# Altium schematic sheet MCU.SchDoc: Title
size A2; Date: Date; CompanyName: Integrated Micro-Electronics Bulgaria; Organization: Design & Development Department; Address1: Drawing Type; Address2: Address 1; Address3: Address 2; Address4: Address 3; DocumentNumber: 730xxx; Revision: 01; SheetNumber: 1; SheetTotal: 1; PageSetup: Record=PageOptions|CenterHorizontal=True|CenterVertical=True|PrintScale=0.70|XCorrection=1.00|YCorrection=1.00|PrintKind=2|BorderSize=5000000|LeftOffset=0|BottomOffset=0|Orientation=2|PaperLength=1000|PaperWidth=1000|Scale=100|PaperSource=7|PrintQuality=-4|MediaType=1|DitherType=10|PaperKind=A4|PrintScaleMode=1; SheetSize: A3; Time: Time; ModifiedDate: Mod. Date
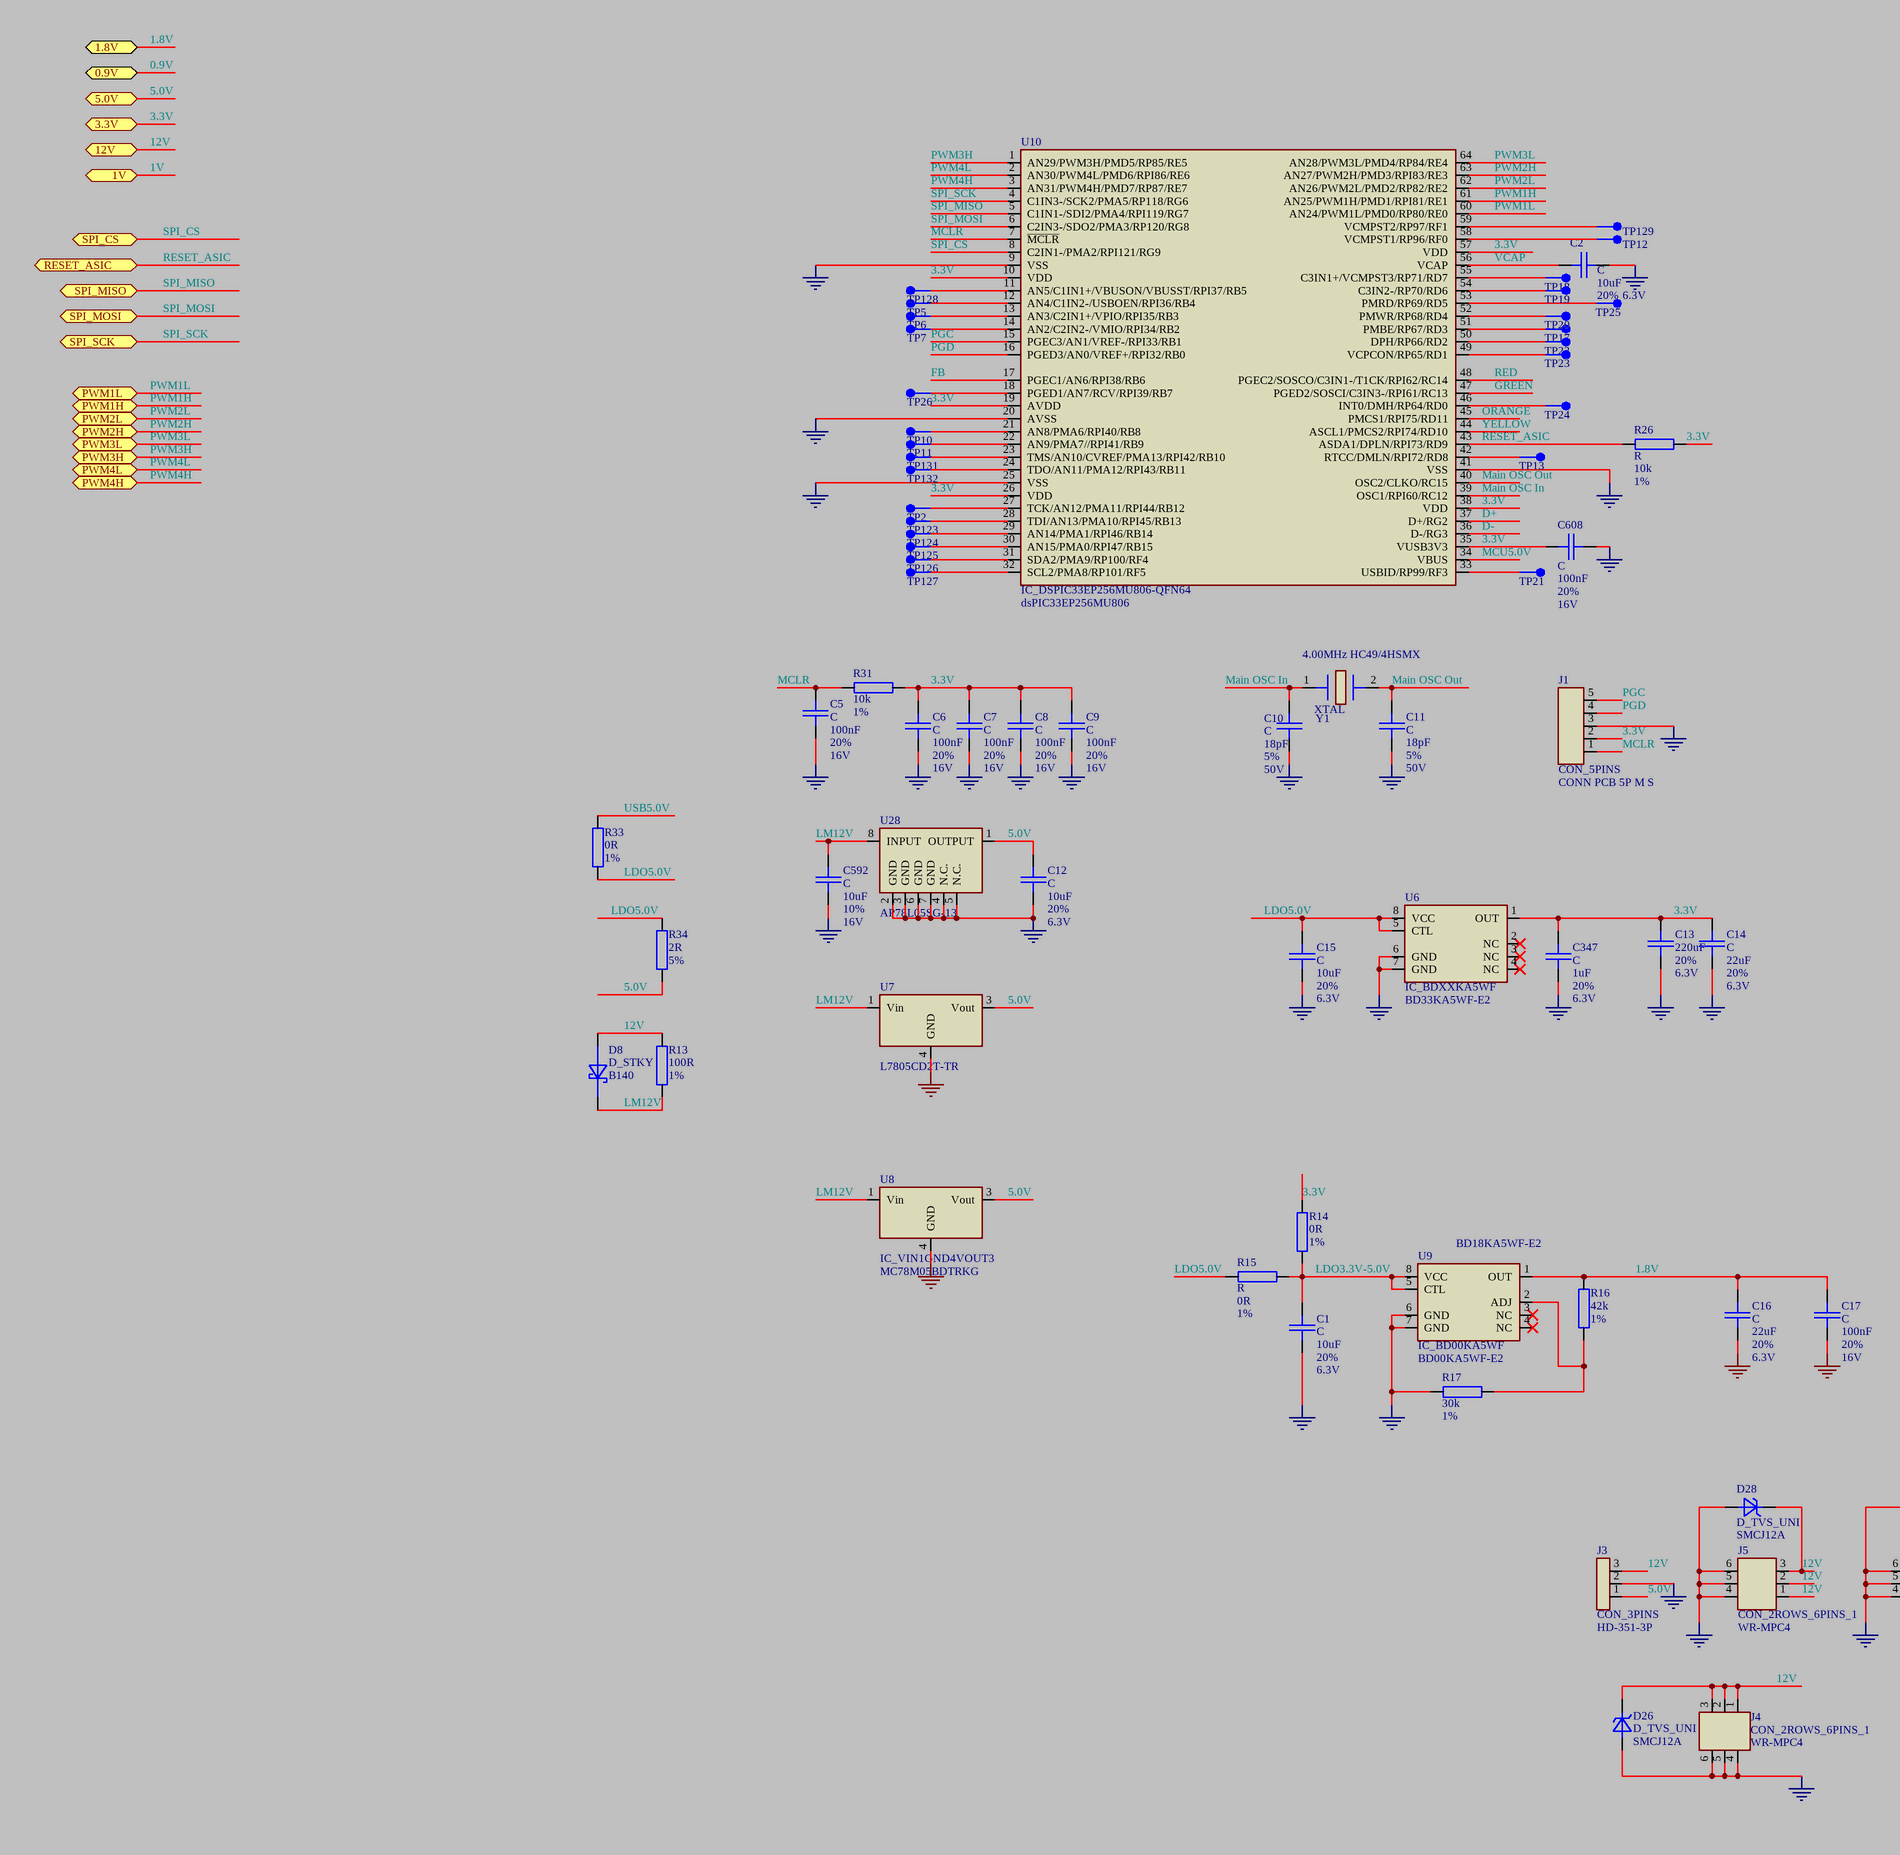
[diagram p0: MCU.SchDoc, left]
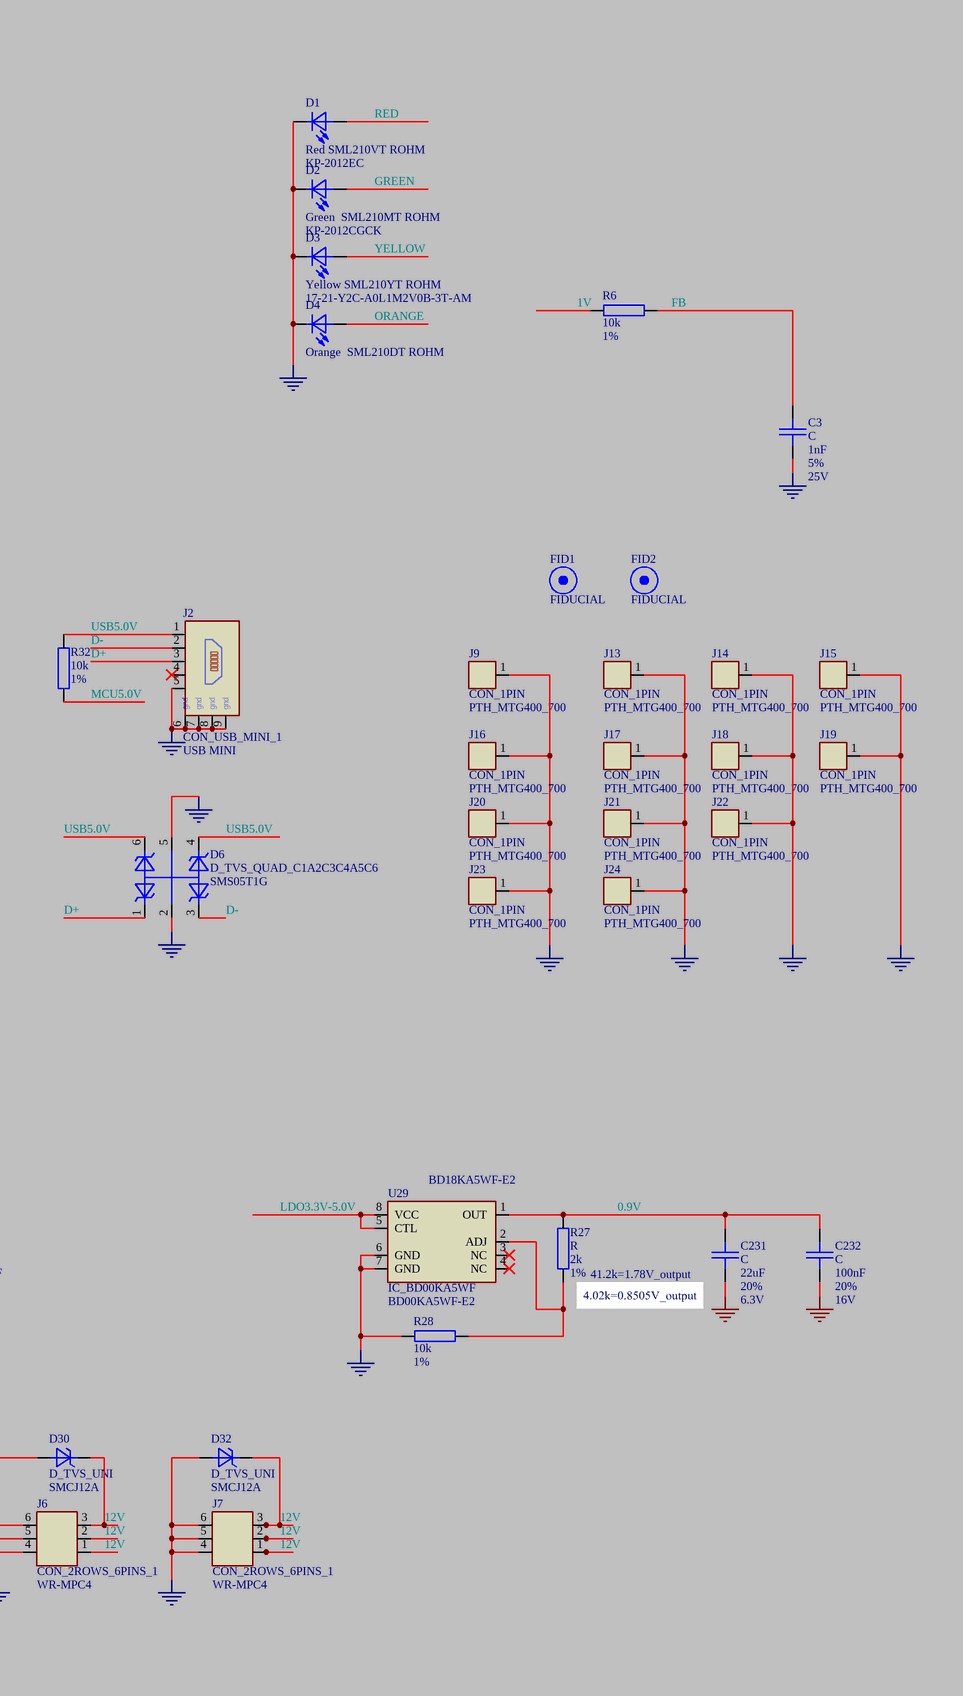
[diagram p1: MCU.SchDoc, right]

## Parts
C1  C  DB_VALUE: 10uF  DB_TOLERANCE: 20%  DB_VOLTAGE: 6.3V  [SMD_0603_CAPC1608X95N]
C2  C  DB_VALUE: 10uF  DB_TOLERANCE: 20%  DB_VOLTAGE: 6.3V  [SMD_0603_CAPC1608X95N]
C3  C  DB_VALUE: 1nF  DB_TOLERANCE: 5%  DB_VOLTAGE: 25V  [SMD_0603_CAPC1608X95N]
C5  C  DB_VALUE: 100nF  DB_TOLERANCE: 20%  DB_VOLTAGE: 16V  [SMD_0603_CAPC1608X95N]
C6  C  DB_VALUE: 100nF  DB_TOLERANCE: 20%  DB_VOLTAGE: 16V  [SMD_0603_CAPC1608X95N]
C7  C  DB_VALUE: 100nF  DB_TOLERANCE: 20%  DB_VOLTAGE: 16V  [SMD_0603_CAPC1608X95N]
C8  C  DB_VALUE: 100nF  DB_TOLERANCE: 20%  DB_VOLTAGE: 16V  [SMD_0603_CAPC1608X95N]
C9  C  DB_VALUE: 100nF  DB_TOLERANCE: 20%  DB_VOLTAGE: 16V  [SMD_0603_CAPC1608X95N]
C10  C  DB_VALUE: 18pF  DB_TOLERANCE: 5%  DB_VOLTAGE: 50V  [SMD_0603_CAPC1608X95N]
C11  C  DB_VALUE: 18pF  DB_TOLERANCE: 5%  DB_VOLTAGE: 50V  [SMD_0603_CAPC1608X95N]
C12  C  DB_VALUE: 10uF  DB_TOLERANCE: 20%  DB_VOLTAGE: 6.3V  [SMD_0603_CAPC1608X95N]
C13  DB_VALUE: 220uF  DB_TOLERANCE: 20%  DB_VOLTAGE: 6.3V  [SMD_1210_CAPC3225X279N]  (hidden comment: C)
C14  C  DB_VALUE: 22uF  DB_TOLERANCE: 20%  DB_VOLTAGE: 6.3V  [SMD_0805_CAPC2012X145N]
C15  C  DB_VALUE: 10uF  DB_TOLERANCE: 20%  DB_VOLTAGE: 6.3V  [SMD_0603_CAPC1608X95N]
C16  C  DB_VALUE: 22uF  DB_TOLERANCE: 20%  DB_VOLTAGE: 6.3V  [SMD_0805_CAPC2012X145N]
C17  C  DB_VALUE: 100nF  DB_TOLERANCE: 20%  DB_VOLTAGE: 16V  [SMD_0603_CAPC1608X95N]
C231  C  DB_VALUE: 22uF  DB_TOLERANCE: 20%  DB_VOLTAGE: 6.3V  [SMD_0805_CAPC2012X145N]
C232  C  DB_VALUE: 100nF  DB_TOLERANCE: 20%  DB_VOLTAGE: 16V  [SMD_0603_CAPC1608X95N]
C347  C  DB_VALUE: 1uF  DB_TOLERANCE: 20%  DB_VOLTAGE: 6.3V  [SMD_0603_CAPC1608X95N]
C592  C  DB_VALUE: 10uF  DB_TOLERANCE: 10%  DB_VOLTAGE: 16V  [SMD_0805_CAPC2012X145N]
C608  C  DB_VALUE: 100nF  DB_TOLERANCE: 20%  DB_VOLTAGE: 16V  [SMD_0603_CAPC1608X95N]
D1  Red SML210VT ROHM  DB_VALUE: KP-2012EC  [SMD_0805_LED2012X100N]
D2  Green  SML210MT ROHM  DB_VALUE: KP-2012CGCK  [SMD_0805_LED2012X100N]
D3  Yellow SML210YT ROHM  DB_VALUE: 17-21-Y2C-A0L1M2V0B-3T-AM  [SMD_0805_LED2012X100N]
D4  Orange  SML210DT ROHM  [SMD_0805_LED2012X100N]
D6  D_TVS_QUAD_C1A2C3C4A5C6  DB_VALUE: SMS05T1G  [SMD_SOT457_SOT95P275X110-6N]
D8  D_STKY  DB_VALUE: B140  [SMD_DO214AC_SMA]
D26  D_TVS_UNI  DB_VALUE: SMCJ12A  [SMD_DO214AC_SMC]
D28  D_TVS_UNI  DB_VALUE: SMCJ12A  [SMD_DO214AC_SMC]
D30  D_TVS_UNI  DB_VALUE: SMCJ12A  [SMD_DO214AC_SMC]
D32  D_TVS_UNI  DB_VALUE: SMCJ12A  [SMD_DO214AC_SMC]
FID1  FIDUCIAL  [FID100X200]
FID2  FIDUCIAL  [FID100X200]
J1  CON_5PINS  DB_VALUE: CONN PCB 5P M S  [PTH_HDRV05W64P254_1X05]
J2  CON_USB_MINI_1  DB_VALUE: USB MINI  [SMD_CON-CVILUX-CU04-SCM15B0]
J3  CON_3PINS  DB_VALUE: HD-351-3P  [PTH_CON_HD-351-3P]
J4  CON_2ROWS_6PINS_1  DB_VALUE: WR-MPC4  [PTH_CON_WR-MRC4-6P]
J5  CON_2ROWS_6PINS_1  DB_VALUE: WR-MPC4  [PTH_CON_WR-MRC4-6P]
J6  CON_2ROWS_6PINS_1  DB_VALUE: WR-MPC4  [PTH_CON_WR-MRC4-6P]
J7  CON_2ROWS_6PINS_1  DB_VALUE: WR-MPC4  [PTH_CON_WR-MRC4-6P]
J9  CON_1PIN  [PTH_MTG400_700]
J13  CON_1PIN  [PTH_MTG400_700]
J14  CON_1PIN  [PTH_MTG400_700]
J15  CON_1PIN  [PTH_MTG400_700]
J16  CON_1PIN  [PTH_MTG400_700]
J17  CON_1PIN  [PTH_MTG400_700]
J18  CON_1PIN  [PTH_MTG400_700]
J19  CON_1PIN  [PTH_MTG400_700]
J20  CON_1PIN  [PTH_MTG400_700]
J21  CON_1PIN  [PTH_MTG400_700]
J22  CON_1PIN  [PTH_MTG400_700]
J23  CON_1PIN  [PTH_MTG400_700]
J24  CON_1PIN  [PTH_MTG400_700]
R6  DB_VALUE: 10k  DB_TOLERANCE: 1%  [SMD_0603_RESC1608X55N]  (hidden comment: R)
R13  DB_VALUE: 100R  DB_TOLERANCE: 1%  [SMD_1206_RESC3216X65N]  (hidden comment: R)
R14  DB_VALUE: 0R  DB_TOLERANCE: 1%  [SMD_1206_RESC3216X65N]  (hidden comment: R)
R15  R  DB_VALUE: 0R  DB_TOLERANCE: 1%  [SMD_1206_RESC3216X65N]
R16  DB_VALUE: 42k  DB_TOLERANCE: 1%  [SMD_0603_RESC1608X55N]  (hidden comment: R_42k)
R17  DB_VALUE: 30k  DB_TOLERANCE: 1%  [SMD_0603_RESC1608X55N]  (hidden comment: R)
R26  R  DB_VALUE: 10k  DB_TOLERANCE: 1%  [SMD_0603_RESC1608X55N]
R27  R  DB_VALUE: 2k  DB_TOLERANCE: 1%  [SMD_0603_RESC1608X55N]
R28  DB_VALUE: 10k  DB_TOLERANCE: 1%  [SMD_0603_RESC1608X55N]  (hidden comment: R)
R31  DB_VALUE: 10k  DB_TOLERANCE: 1%  [SMD_0603_RESC1608X55N]  (hidden comment: R)
R32  DB_VALUE: 10k  DB_TOLERANCE: 1%  [SMD_0603_RESC1608X55N]  (hidden comment: R)
R33  DB_VALUE: 0R  DB_TOLERANCE: 1%  [SMD_0603_RESC1608X55N]  (hidden comment: R)
R34  DB_VALUE: 2R  DB_TOLERANCE: 5%  [SMD_1206_RESC3216X65N]  (hidden comment: R)
TP2  TEST_POINT_1  [SMD_TP_100-254]  (value not drawn)
TP5  TEST_POINT_1  [SMD_TP_100-254]  (value not drawn)
TP6  TEST_POINT_1  [SMD_TP_100-254]  (value not drawn)
TP7  TEST_POINT_1  [SMD_TP_100-254]  (value not drawn)
TP10  TEST_POINT_1  [SMD_TP_100-254]  (value not drawn)
TP11  TEST_POINT_1  [SMD_TP_100-254]  (value not drawn)
TP12  TEST_POINT_1  [SMD_TP_100-254]  (value not drawn)
TP13  TEST_POINT_1  [SMD_TP_100-254]  (value not drawn)
TP17  TEST_POINT_1  [SMD_TP_100-254]  (value not drawn)
TP18  TEST_POINT_1  [SMD_TP_100-254]  (value not drawn)
TP19  TEST_POINT_1  [SMD_TP_100-254]  (value not drawn)
TP20  TEST_POINT_1  [SMD_TP_100-254]  (value not drawn)
TP21  TEST_POINT_1  [SMD_TP_100-254]  (value not drawn)
TP22  TEST_POINT_1  [SMD_TP_100-254]  (value not drawn)
TP23  TEST_POINT_1  [SMD_TP_100-254]  (value not drawn)
TP24  TEST_POINT_1  [SMD_TP_100-254]  (value not drawn)
TP25  TEST_POINT_1  [SMD_TP_100-254]  (value not drawn)
TP26  TEST_POINT_1  [SMD_TP_100-254]  (value not drawn)
TP123  TEST_POINT_1  [SMD_TP_100-254]  (value not drawn)
TP124  TEST_POINT_1  [SMD_TP_100-254]  (value not drawn)
TP125  TEST_POINT_1  [SMD_TP_100-254]  (value not drawn)
TP126  TEST_POINT_1  [SMD_TP_100-254]  (value not drawn)
TP127  TEST_POINT_1  [SMD_TP_100-254]  (value not drawn)
TP128  TEST_POINT_1  [SMD_TP_100-254]  (value not drawn)
TP129  TEST_POINT_1  [SMD_TP_100-254]  (value not drawn)
TP131  TEST_POINT_1  [SMD_TP_100-254]  (value not drawn)
TP132  TEST_POINT_1  [SMD_TP_100-254]  (value not drawn)
U6  IC_BDXXKA5WF  DB_VALUE: BD33KA5WF-E2  [SMD_SOIC127P620X160-8N]
U7  DB_VALUE: L7805CD2T-TR  [SMD_TO254P1542X460-3_4N]  (hidden comment: IC_IN1OUT3GND4)
U8  IC_VIN1GND4VOUT3  DB_VALUE: MC78M05BDTRKG  [SMD_TO229P991X239-4N_DPAK]
U9  IC_BD00KA5WF  DB_VALUE: BD00KA5WF-E2  [SMD_SOIC127P620X160-8N]
U10  IC_DSPIC33EP256MU806-QFN64  DB_VALUE: dsPIC33EP256MU806  [SMD_QFP50P1200X1200X120-64N]
U28  DB_VALUE: AP78L05SG-13  [SMD_SOIC127P600X175-8N]  (hidden comment: IC_LM2931AD-5.0R2G_SO-8)
U29  IC_BD00KA5WF  DB_VALUE: BD00KA5WF-E2  [SMD_SOIC127P620X160-8N]
Y1  XTAL  DB_VALUE: 4.00MHz HC49/4HSMX  [SMD_HC49_XTAL1140X480X420N]

## Ports
0.9V, 1.8V, 1V, 3.3V, 5.0V, 12V, PWM1H, PWM1L, PWM2H, PWM2L, PWM3H, PWM3L, PWM4H, PWM4L, RESET_ASIC, SPI_CS, SPI_MISO, SPI_MOSI, SPI_SCK

## Nets
GND: C1.2 C2.2 C3.2 C5.2 C6.2 C7.2 C8.2 C9.2 C10.2 C11.2 C12.2 C13.1 C14.2 C15.2 C16.2 C17.2 C231.2 C232.2 C347.2 C592.2 C608.2 D1.1(C) D2.1(C) D3.1(C) D4.1(C) D6.2 D6.5 D26.2(A) D28.2(A) D30.2(A) D32.2(A) J1.3 J2.5 J2.6 J2.7 J2.8 J2.9 J3.2 J4.4 J4.5 J4.6 J5.4 J5.5 J5.6 J6.4 J6.5 J6.6 J7.4 J7.5 J7.6 J9.1 J13.1 J14.1 J15.1 J16.1 J17.1 J18.1 J19.1 J20.1 J21.1 J22.1 J23.1 J24.1 R17.2 R28.2 U6.6(GND) U6.7(GND) U7.4(GND) U8.4(GND) U9.6(GND) U9.7(GND) U10.9(VSS) U10.20(AVSS) U10.25(VSS) U10.41(VSS) U28.2(GND) U28.3(GND) U28.4(N.C.) U28.5(N.C.) U28.6(GND) U28.7(GND) U29.6(GND) U29.7(GND)
0.9V: C231.1 C232.1 R27.1 U29.1(OUT) ; port 0.9V
1.8V: C16.1 C17.1 R16.1 U9.1(OUT) ; port 1.8V
1V: R6.2 ; port 1V
3.3V: C6.1 C7.1 C8.1 C9.1 C13.2 C14.1 C347.1 C608.1 J1.2 R14.2 R26.1 R31.2 U6.1(OUT) U10.10(VDD) U10.19(AVDD) U10.26(VDD) U10.35(VUSB3V3) U10.38(VDD) U10.57(VDD) ; port 3.3V
5.0V: C12.1 J3.1 R34.1 U7.3(Vout) U8.3(Vout) U28.1(OUTPUT) ; port 5.0V
12V: D8.2(A) D26.1(C) D28.1(C) D30.1(C) D32.1(C) J3.3 J4.1 J4.2 J4.3 J5.1 J5.2 J5.3 J6.1 J6.2 J6.3 J7.1 J7.2 J7.3 R13.2 ; port 12V
D+: D6.1 J2.3 U10.37(D+/RG2)
D-: D6.3 J2.2 U10.36(D-/RG3)
FB: C3.1 R6.1 U10.17(PGEC1/AN6/RPI38/RB6)
GREEN: D2.2(A) U10.47(PGED2/SOSCI/C3IN3-/RPI61/RC13)
LDO3.3V-5.0V: C1.1 R14.1 R15.1 U9.5(CTL) U9.8(VCC) U29.5(CTL) U29.8(VCC)
LDO5.0V: C15.1 R15.2 R33.1 R34.2 U6.5(CTL) U6.8(VCC)
LM12V: C592.1 D8.1(C) R13.1 U7.1(Vin) U8.1(Vin) U28.8(INPUT)
Main OSC In: C10.1 U10.39(OSC1/RPI60/RC12) Y1.1
Main OSC Out: C11.1 U10.40(OSC2/CLKO/RC15) Y1.2
MCLR: C5.1 J1.1 R31.1 U10.7(~{MCLR})
MCU5.0V: R32.2 U10.34(VBUS)
ORANGE: D4.2(A) U10.45(PMCS1/RPI75/RD11)
PGC: J1.5 U10.15(PGEC3/AN1/VREF-/RPI33/RB1)
PGD: J1.4 U10.16(PGED3/AN0/VREF+/RPI32/RB0)
PWM1H: U10.61(AN25/PWM1H/PMD1/RPI81/RE1) ; port PWM1H
PWM1L: U10.60(AN24/PWM1L/PMD0/RP80/RE0) ; port PWM1L
PWM2H: U10.63(AN27/PWM2H/PMD3/RPI83/RE3) ; port PWM2H
PWM2L: U10.62(AN26/PWM2L/PMD2/RP82/RE2) ; port PWM2L
PWM3H: U10.1(AN29/PWM3H/PMD5/RP85/RE5) ; port PWM3H
PWM3L: U10.64(AN28/PWM3L/PMD4/RP84/RE4) ; port PWM3L
PWM4H: U10.3(AN31/PWM4H/PMD7/RP87/RE7) ; port PWM4H
PWM4L: U10.2(AN30/PWM4L/PMD6/RPI86/RE6) ; port PWM4L
RED: D1.2(A) U10.48(PGEC2/SOSCO/C3IN1-/T1CK/RPI62/RC14)
RESET_ASIC: R26.2 U10.43(ASDA1/DPLN/RPI73/RD9) ; port RESET_ASIC
SPI_CS: U10.8(C2IN1-/PMA2/RPI121/RG9) ; port SPI_CS
SPI_MISO: U10.5(C1IN1-/SDI2/PMA4/RPI119/RG7) ; port SPI_MISO
SPI_MOSI: U10.6(C2IN3-/SDO2/PMA3/RP120/RG8) ; port SPI_MOSI
SPI_SCK: U10.4(C1IN3-/SCK2/PMA5/RP118/RG6) ; port SPI_SCK
USB5.0V: D6.4 D6.6 J2.1 R32.1 R33.2
VCAP: C2.1 U10.56(VCAP)
YELLOW: D3.2(A) U10.44(ASCL1/PMCS2/RPI74/RD10)
NetR16_2: R16.2 R17.1 U9.2(ADJ)
NetR27_2: R27.2 R28.1 U29.2(ADJ)
NetTP2_1: TP2.1 U10.27(TCK/AN12/PMA11/RPI44/RB12)
NetTP5_1: TP5.1 U10.12(AN4/C1IN2-/USBOEN/RPI36/RB4)
NetTP6_1: TP6.1 U10.13(AN3/C2IN1+/VPIO/RPI35/RB3)
NetTP7_1: TP7.1 U10.14(AN2/C2IN2-/VMIO/RPI34/RB2)
NetTP10_1: TP10.1 U10.21(AN8/PMA6/RPI40/RB8)
NetTP11_1: TP11.1 U10.22(AN9/PMA7//RPI41/RB9)
NetTP12_1: TP12.1 U10.58(VCMPST1/RP96/RF0)
NetTP13_1: TP13.1 U10.42(RTCC/DMLN/RPI72/RD8)
NetTP17_1: TP17.1 U10.51(PMBE/RP67/RD3)
NetTP18_1: TP18.1 U10.55(C3IN1+/VCMPST3/RP71/RD7)
NetTP19_1: TP19.1 U10.54(C3IN2-/RP70/RD6)
NetTP20_1: TP20.1 U10.52(PMWR/RP68/RD4)
NetTP21_1: TP21.1 U10.33(USBID/RP99/RF3)
NetTP22_1: TP22.1 U10.50(DPH/RP66/RD2)
NetTP23_1: TP23.1 U10.49(VCPCON/RP65/RD1)
NetTP24_1: TP24.1 U10.46(INT0/DMH/RP64/RD0)
NetTP25_1: TP25.1 U10.53(PMRD/RP69/RD5)
NetTP26_1: TP26.1 U10.18(PGED1/AN7/RCV/RPI39/RB7)
NetTP123_1: TP123.1 U10.28(TDI/AN13/PMA10/RPI45/RB13)
NetTP124_1: TP124.1 U10.29(AN14/PMA1/RPI46/RB14)
NetTP125_1: TP125.1 U10.30(AN15/PMA0/RPI47/RB15)
NetTP126_1: TP126.1 U10.31(SDA2/PMA9/RP100/RF4)
NetTP127_1: TP127.1 U10.32(SCL2/PMA8/RP101/RF5)
NetTP128_1: TP128.1 U10.11(AN5/C1IN1+/VBUSON/VBUSST/RPI37/RB5)
NetTP129_1: TP129.1 U10.59(VCMPST2/RP97/RF1)
NetTP131_1: TP131.1 U10.23(TMS/AN10/CVREF/PMA13/RPI42/RB10)
NetTP132_1: TP132.1 U10.24(TDO/AN11/PMA12/RPI43/RB11)

Not connected (* = marked no-connect by the designer): J2 4*; U6 2(NC)* 3(NC)* 4(NC)*; U9 3(NC)* 4(NC)*; U29 3(NC)* 4(NC)*

## Notes on the sheet
- (near U9) BD18KA5WF-E2
- (near U29) BD18KA5WF-E2
- 41.2k=1.78V_output
- (in symbol CON000000048) gnd

## Library data of the parts
C1 C2 C12 C15 = CAP000043646: DB_MANUFACTURER_PART: KEMET    C0603C106M9PAC; DB_PART_TYPE: Ceramic_SMD\Standard_X5R; NOTE: <NOTE>; DB_APPROVED_BY: ISHIDDEN=T; DB_DESCRIPTION: C X5R 10uF 20% 6.3V 0603; DB_PACKAGE: 0603; DB_STATUS: NEW; DB_T_RANGE: -55 to 85; DB_PART_NUMBER: CAP000043646; DB_APPROVED_ON: 09.10.2010; DB_CERTIFIED: ISHIDDEN=T; DB_DATASHEET: http://john.epiqdesign.com/projects/CIS_Datasheets/F3102_CE_Kemet.pdf?rev=92&sc=0; DB_LEADTIME: ISHIDDEN=T; DB_MOQ: ISHIDDEN=T; DB_PCB_DEVICE: SMD_0603_CAPC1608X95N; DB_PRICE: ISHIDDEN=T; DB_PRICE_DATE: ISHIDDEN=T
C3 = CAP000024113: DB_PART_TYPE: Ceramic_SMD\Standard_X7R; DB_MANUFACTURER_PART: KEMET    C0603C102J3RAC; NOTE: <NOTE>; DB_T_RANGE: -55 to 125; DB_PACKAGE: 0603; DB_DESCRIPTION: C X7R 1nF 5% 25V 0603; DB_CERTIFIED: ISHIDDEN=T; DB_STATUS: NEW; DB_PART_NUMBER: CAP000024113; DB_PCB_DEVICE: SMD_0603_CAPC1608X95N; DB_PRICE: ISHIDDEN=T; DB_LEADTIME: ISHIDDEN=T; DB_MOQ: ISHIDDEN=T; DB_PRICE_DATE: ISHIDDEN=T; DB_APPROVED_BY: ISHIDDEN=T; DB_APPROVED_ON: 09.10.2010; DB_DATASHEET: http://john.epiqdesign.com/projects/CIS_Datasheets/F3102_CE_Kemet.pdf?rev=92&sc=0
C5-C9 C17 C232 C608 = CAP000027236: DB_MANUFACTURER_PART: KEMET    C0603C104M4RAC; DB_PART_TYPE: Ceramic_SMD\Standard_X7R; NOTE: <NOTE>; DB_APPROVED_BY: ISHIDDEN=T; DB_DESCRIPTION: C X7R 100nF 20% 16V 0603; DB_PACKAGE: 0603; DB_STATUS: NEW; DB_T_RANGE: -55 to 125; DB_PART_NUMBER: CAP000027236; DB_APPROVED_ON: 09.10.2010; DB_CERTIFIED: ISHIDDEN=T; DB_DATASHEET: http://john.epiqdesign.com/projects/CIS_Datasheets/F3102_CE_Kemet.pdf?rev=92&sc=0; DB_LEADTIME: ISHIDDEN=T; DB_MOQ: ISHIDDEN=T; DB_PCB_DEVICE: SMD_0603_CAPC1608X95N; DB_PRICE: ISHIDDEN=T; DB_PRICE_DATE: ISHIDDEN=T
C10 C11 = CAP000031922: DB_PART_TYPE: Ceramic_SMD\Standard_C0G; DB_MANUFACTURER_PART: KEMET    C0603C180J5GAC; NOTE: <NOTE>; DB_T_RANGE: -55 to 125; DB_PACKAGE: 0603; DB_DESCRIPTION: C C0G 18pF 5% 50V 0603; DB_CERTIFIED: ISHIDDEN=T; DB_STATUS: NEW; DB_PART_NUMBER: CAP000031922; DB_PCB_DEVICE: SMD_0603_CAPC1608X95N; DB_PRICE: ISHIDDEN=T; DB_LEADTIME: ISHIDDEN=T; DB_MOQ: ISHIDDEN=T; DB_PRICE_DATE: ISHIDDEN=T; DB_APPROVED_BY: ISHIDDEN=T; DB_APPROVED_ON: 09.10.2010; DB_DATASHEET: http://john.epiqdesign.com/projects/CIS_Datasheets/F3102_CE_Kemet.pdf?rev=92&sc=0
C13 = CAP000047355: DB_PART_TYPE: Ceramic_SMD\Standard_X5R; DB_MANUFACTURER_PART: SAMSUNG    CL32A227MQVNNNE; NOTE: <NOTE>; DB_T_RANGE: -55 to 85; DB_PACKAGE: 1210; DB_DESCRIPTION: C X5R 220uF 20% 6.3V 1210; DB_CERTIFIED: ISHIDDEN=T; DB_APPROVED_BY: VSN; DB_STATUS: NEW; DB_PART_NUMBER: CAP000047355; DB_PCB_DEVICE: SMD_1210_CAPC3225X279N; DB_APPROVED_ON: 07.05.2014 11:28:08; DB_DATASHEET: http://john.epiqdesign.com/projects/CIS_Datasheets/CAP_CL32A227MQVNNNE.pdf?rev=1401&sc=0
C14 C16 C231 = CAP000043686: DB_PART_TYPE: Ceramic_SMD\Standard_X5R; DB_MANUFACTURER_PART: KEMET    C0805C226M9PAC; NOTE: <NOTE>; DB_T_RANGE: -55 to 85; DB_PACKAGE: 0805; DB_DESCRIPTION: C X5R 22uF 20% 6.3V 0805; DB_CERTIFIED: ISHIDDEN=T; DB_STATUS: NEW; DB_PART_NUMBER: CAP000043686; DB_PCB_DEVICE: SMD_0805_CAPC2012X145N; DB_PRICE: ISHIDDEN=T; DB_LEADTIME: ISHIDDEN=T; DB_MOQ: ISHIDDEN=T; DB_PRICE_DATE: ISHIDDEN=T; DB_APPROVED_BY: ISHIDDEN=T; DB_APPROVED_ON: 09.10.2010; DB_DATASHEET: http://john.epiqdesign.com/projects/CIS_Datasheets/F3102_CE_Kemet.pdf?rev=92&sc=0
C347 = CAP000043344: DB_PART_TYPE: Ceramic_SMD\Standard_X5R; DB_MANUFACTURER_PART: KEMET    C0603C105M9PAC; NOTE: <NOTE>; DB_T_RANGE: -55 to 85; DB_PACKAGE: 0603; DB_DESCRIPTION: C X5R 1uF 20% 6.3V 0603; DB_CERTIFIED: ISHIDDEN=T; DB_STATUS: NEW; DB_PART_NUMBER: CAP000043344; DB_PCB_DEVICE: SMD_0603_CAPC1608X95N; DB_PRICE: ISHIDDEN=T; DB_LEADTIME: ISHIDDEN=T; DB_MOQ: ISHIDDEN=T; DB_PRICE_DATE: ISHIDDEN=T; DB_APPROVED_BY: ISHIDDEN=T; DB_APPROVED_ON: 09.10.2010; DB_DATASHEET: http://john.epiqdesign.com/projects/CIS_Datasheets/F3102_CE_Kemet.pdf?rev=92&sc=0
C592 = CAP000043636: DB_PART_TYPE: Ceramic_SMD\Standard_X5R; DB_MANUFACTURER_PART: KEMET    C0805C106K4PAC; NOTE: <NOTE>; DB_T_RANGE: -55 to 85; DB_PACKAGE: 0805; DB_DESCRIPTION: C X5R 10uF 10% 16V 0805; DB_CERTIFIED: ISHIDDEN=T; DB_STATUS: NEW; DB_PART_NUMBER: CAP000043636; DB_PCB_DEVICE: SMD_0805_CAPC2012X145N; DB_PRICE: ISHIDDEN=T; DB_LEADTIME: ISHIDDEN=T; DB_MOQ: ISHIDDEN=T; DB_PRICE_DATE: ISHIDDEN=T; DB_APPROVED_BY: ISHIDDEN=T; DB_APPROVED_ON: 09.10.2010; DB_DATASHEET: http://john.epiqdesign.com/projects/CIS_Datasheets/F3102_CE_Kemet.pdf?rev=92&sc=0
D1 = OPT000000095: DB_MANUFACTURER_PART: KINGBRIGHT       KP-2012EC; NOTE: <NOTE>; DB_T_RANGE: -40 to 85; DB_PACKAGE: 0805; DB_DESCRIPTION: LED RED 0805; DB_CERTIFIED: ISHIDDEN=T; DB_APPROVED_BY: VSN; DB_STATUS: NEW; DB_PCB_DEVICE: SMD_0805_LED2012X100N; DB_PART_NUMBER: OPT000000095; DB_PART_TYPE: LED; DB_COLOUR: RED; DB_APPROVED_ON: 08.04.2014 09:20:29; DB_DATASHEET: http://john.epiqdesign.com/projects/CIS_Datasheets/LED_KP-2012EC_0805_RED.pdf?rev=1358&sc=0
D2 = OPT000000096: DB_MANUFACTURER_PART: KINGBRIGHT       KP-2012CGCK; NOTE: <NOTE>; DB_T_RANGE: -40 to 85; DB_PACKAGE: 0805; DB_DESCRIPTION: LED GREEN 0805; DB_CERTIFIED: ISHIDDEN=T; DB_APPROVED_BY: VSN; DB_STATUS: NEW; DB_PCB_DEVICE: SMD_0805_LED2012X100N; DB_PART_NUMBER: OPT000000096; DB_PART_TYPE: LED; DB_COLOUR: GREEN; DB_APPROVED_ON: 08.04.2014 09:22:12; DB_DATASHEET: http://john.epiqdesign.com/projects/CIS_Datasheets/LED_KP-2012CGCK_0805_GREEN.pdf?rev=1359&sc=0
D3 = OPT000000092: DB_MANUFACTURER_PART: EVERLIGHT       17-21-Y2C-A0L1M2V0B-3T-AM; NOTE: <NOTE>; DB_T_RANGE: -40 to 100; DB_PACKAGE: 0805; DB_DESCRIPTION: LED YELLOW 0805; DB_CERTIFIED: AUT; DB_APPROVED_BY: VSN; DB_STATUS: NEW; DB_PCB_DEVICE: SMD_0805_LED2012X100N; DB_PART_NUMBER: OPT000000092; DB_PART_TYPE: LED; DB_COLOUR: YELLOW; DB_APPROVED_ON: 17.06.2013 13:21:58; DB_DATASHEET: http://john.epiqdesign.com/projects/CIS_Datasheets/LED_17-21-Y2C-A0L1M2V0B-3T-AM.pdf?rev=1220&sc=0
D4 = OPT000000096: DB_PART_TYPE: LED; DB_MANUFACTURER_PART: KINGBRIGHT       KP-2012CGCK; NOTE: <NOTE>; DB_T_RANGE: -40 to 85; DB_COLOUR: GREEN; DB_PACKAGE: 0805; DB_DESCRIPTION: LED GREEN 0805; DB_CERTIFIED: ISHIDDEN=T; DB_APPROVED_BY: VSN; DB_STATUS: NEW; DB_VALUE: KP-2012CGCK; DB_PCB_DEVICE: SMD_0805_LED2012X100N; DB_PART_NUMBER: OPT000000096; DB_APPROVED_ON: 08.04.2014 09:22:12; DB_DATASHEET: http://john.epiqdesign.com/projects/CIS_Datasheets/LED_KP-2012CGCK_0805_GREEN.pdf?rev=1359&sc=0
D6 = DDE000002846: DB_PART_TYPE: ESD protection; DB_MANUFACTURER_PART: ON SEMICONDUCTOR        SMS05T1G; DB_T_RANGE: -55 to 150; DB_VOLTAGE: 5V; DB_PACKAGE: SC-74; DB_DESCRIPTION: D SMS05T1G SC-74; DB_CERTIFIED: ISHIDDEN=T; DB_APPROVED_BY: VSN; DB_STATUS: NEW; DB_PART_NUMBER: DDE000002846; DB_PCB_DEVICE: SMD_SOT457_SOT95P275X110-6N; DB_APPROVED_ON: 24.03.2014 10:22:08; DB_DATASHEET: http://john.epiqdesign.com/projects/CIS_Datasheets/IC_SMS05T1-D.pdf?rev=1323&sc=0
D8 = DDE000000580: DB_PART_TYPE: Schottky; DB_MANUFACTURER_PART: Diodes        B140; NOTE: <NOTE>; DB_T_RANGE: -65 to +150; DB_VOLTAGE: 40V; DB_CURRENT: 1A; DB_PACKAGE: SMA; DB_DESCRIPTION: D B140 SMA; DB_CERTIFIED: ISHIDDEN=T; DB_STATUS: NEW; DB_PART_NUMBER: DDE000000580; DB_PCB_DEVICE: SMD_DO214AC_SMA; DB_PRICE: ISHIDDEN=T; DB_LEADTIME: ISHIDDEN=T; DB_MOQ: ISHIDDEN=T; DB_PRICE_DATE: ISHIDDEN=T; DB_APPROVED_BY: ISHIDDEN=T; DB_APPROVED_ON: 09.10.2010; DB_DATASHEET: ISHIDDEN=T
D26 D28 D30 D32 = DDE000001725: DB_PART_TYPE: TVS; DB_MANUFACTURER_PART: Diodes        SMCJ12A; NOTE: <NOTE>; DB_T_RANGE: -55 to 150; DB_VOLTAGE: 12V; DB_CURRENT: 75A(Max); DB_PACKAGE: SMC; DB_DESCRIPTION: D SMCJ12A SMC; DB_CERTIFIED: ISHIDDEN=T; DB_STATUS: NEW; DB_PART_NUMBER: DDE000001725; DB_PCB_DEVICE: SMD_DO214AC_SMC; DB_PRICE: ISHIDDEN=T; DB_LEADTIME: ISHIDDEN=T; DB_MOQ: ISHIDDEN=T; DB_PRICE_DATE: ISHIDDEN=T; DB_APPROVED_BY: ISHIDDEN=T; DB_APPROVED_ON: 09.10.2010; DB_DATASHEET: ISHIDDEN=T
FID1 FID2 = FID000000001: NOTE: <NOTE>; DB_VALUE: FIDUCIAL 100X200; DB_DIAMETER: 100X200; DB_PACKAGE: ISHIDDEN=T; DB_STATUS: NEW; DB_PART_NUMBER: FID000000001; DB_PART_TYPE: FIDUCIAL; DB_DESCRIPTION: FIDUCIAL 100x200; DB_PCB_DEVICE: FID100X200; DB_MANUFACTURER_PART: ISHIDDEN=T; DB_CERTIFIED: ISHIDDEN=T; DB_PRICE: ISHIDDEN=T; DB_LEADTIME: ISHIDDEN=T; DB_MOQ: ISHIDDEN=T; DB_PRICE_DATE: ISHIDDEN=T; DB_APPROVED_BY: ISHIDDEN=T; DB_APPROVED_ON: 10.09.2010; DB_DATASHEET: ISHIDDEN=T
J1 = CON000000006: DB_PART_TYPE: Connector; DB_MANUFACTURER_PART: W+P        143-12-005-00; NOTE: <NOTE>; DB_PINS_NUMBER: ISHIDDEN=T; DB_T_RANGE: -55 to 125; DB_PACKAGE: PTH; DB_DESCRIPTION: CONN PCB 5P M S 143-12-005-00; DB_APPROVED_BY: VSN; DB_STATUS: NEW; DB_PART_NUMBER: CON000000006; DB_PITCH: ISHIDDEN=T; DB_VOLTAGE: ISHIDDEN=T; DB_CURRENT: ISHIDDEN=T; DB_IP_CLASS: ISHIDDEN=T; DB_PCB_DEVICE: PTH_HDRV05W64P254_1X05; DB_CERTIFIED: ISHIDDEN=T; DB_PRICE: ISHIDDEN=T; DB_LEADTIME: ISHIDDEN=T; DB_MOQ: ISHIDDEN=T; DB_PRICE_DATE: ISHIDDEN=T; DB_APPROVED_ON: 14.12.2010 10:22:07; DB_DATASHEET: http://john.epiqdesign.com/projects/CIS_Datasheets/143-12-005-00_W+P.pdf?rev=3&sc=0
J2 = CON000000048: DB_PART_TYPE: Connector; DB_MANUFACTURER_PART: CVILUX       CU04-SCM15B0-R0-LF; NOTE: <NOTE>; DB_PINS_NUMBER: 5; DB_PITCH: 0.8; DB_PACKAGE: SMD; DB_DESCRIPTION: CONN  PCB  5P  F  A  USB5 MINI SMD; DB_CERTIFIED: ISHIDDEN=T; DB_APPROVED_BY: VSN; DB_STATUS: NEW; DB_PART_NUMBER: CON000000048; DB_PCB_DEVICE: SMD_CON-CVILUX-CU04-SCM15B0; DB_PRICE: ISHIDDEN=T; DB_LEADTIME: ISHIDDEN=T; DB_MOQ: ISHIDDEN=T; DB_PRICE_DATE: ISHIDDEN=T; DB_APPROVED_ON: 02.05.2011 10:29:38; DB_DATASHEET: http://john.epiqdesign.com/projects/CIS_Datasheets/USB%20MINI_CVILUX.pdf?rev=249&sc=0
J3 = CON000000272: DB_PART_TYPE: Connector; DB_MANUFACTURER_PART: HOW DER      HD-351-3P; DB_PINS_NUMBER: 3; DB_PITCH: 3.5mm; DB_VOLTAGE: 300VAC; DB_CURRENT: 10A; DB_PACKAGE: PTH; DB_DESCRIPTION: CONN PCB 3P; DB_CERTIFIED: ISHIDDEN=T; DB_APPROVED_BY: VSN; DB_STATUS: NEW; DB_PART_NUMBER: CON000000272; DB_PCB_DEVICE: PTH_CON_HD-351-3P; DB_APPROVED_ON: 07.05.2014 14:06:04; DB_DATASHEET: http://john.epiqdesign.com/projects/CIS_Datasheets/CON_hd-351.pdf?rev=1413&sc=0
J4-J7 = CON000000271: DB_PART_TYPE: Connector; DB_MANUFACTURER_PART: WE         649 006 295 22; DB_PINS_NUMBER: 6; DB_PITCH: 4.2mm; DB_T_RANGE: -40 to 105; DB_VOLTAGE: 600VAC; DB_CURRENT: 6 - 9A; DB_PACKAGE: PTH; DB_DESCRIPTION: CONN PCB 6P M A PTH; DB_CERTIFIED: ISHIDDEN=T; DB_APPROVED_BY: VSN; DB_STATUS: NEW; DB_PART_NUMBER: CON000000271; DB_PCB_DEVICE: PTH_CON_WR-MRC4-6P; DB_APPROVED_ON: 07.05.2014 13:56:56; DB_DATASHEET: http://john.epiqdesign.com/projects/CIS_Datasheets/CON_WR-MPC4.pdf?rev=1412&sc=0
J9 J13-J24 = MTH000000030: DB_PART_TYPE: Mounting Hole; NOTE: <NOTE>; DB_DIAMETER: 4mm; DB_PLATED: Yes; DB_DESCRIPTION: Mounting Hole PTH_MTG400_700; DB_CERTIFIED: ISHIDDEN=T; DB_APPROVED_BY: VSN; DB_STATUS: NEW; DB_PART_NUMBER: MTH000000030; DB_VALUE: PTH_MTG400_700; DB_PCB_DEVICE: PTH_MTG400_700; DB_PRICE: ISHIDDEN=T; DB_LEADTIME: ISHIDDEN=T; DB_MOQ: ISHIDDEN=T; DB_PRICE_DATE: ISHIDDEN=T; DB_APPROVED_ON: 02.04.2013 15:54:43
R6 R28 R31 R32 = RES000008663: DB_PART_TYPE: SMD; DB_MANUFACTURER_PART: YAGEO    RC0603FR-0710KL; NOTE: <NOTE>; DB_T_RANGE: -55 to 155; DB_POWER: 1/10W; DB_PACKAGE: 0603; DB_DESCRIPTION: R SMD 10k 1% 1/10W 0603; DB_CERTIFIED: ISHIDDEN=T; DB_APPROVED_BY: VSN; DB_STATUS: NEW; R_BDS: R; DB_PART_NUMBER: RES000008663; DB_PCB_DEVICE: SMD_0603_RESC1608X55N; DB_PRICE: ISHIDDEN=T; DB_LEADTIME: ISHIDDEN=T; DB_MOQ: ISHIDDEN=T; DB_PRICE_DATE: ISHIDDEN=T; DB_APPROVED_ON: 08.08.2011 08:31:51; DB_DATASHEET: http://john.epiqdesign.com/projects/CIS_Datasheets/PYu-RC0603_51_RoHS_L_4_YAGEO.pdf?rev=138&sc=0
R13 = RES000006922: DB_PART_TYPE: SMD; DB_MANUFACTURER_PART: YAGEO    RC1206FR-07100R; NOTE: <NOTE>; DB_T_RANGE: -55 to 155; DB_POWER: 1/4W; DB_PACKAGE: 1206; DB_DESCRIPTION: R SMD 100R 1% 1/4W 1206; DB_CERTIFIED: ISHIDDEN=T; DB_STATUS: NEW; R_BDS: R; DB_PART_NUMBER: RES000006922; DB_PCB_DEVICE: SMD_1206_RESC3216X65N; DB_PRICE: ISHIDDEN=T; DB_LEADTIME: ISHIDDEN=T; DB_MOQ: ISHIDDEN=T; DB_PRICE_DATE: ISHIDDEN=T; DB_APPROVED_BY: ISHIDDEN=T; DB_APPROVED_ON: 09.10.2010; DB_DATASHEET: http://john.epiqdesign.com/projects/CIS_Datasheets/PYu-RC1206_51_RoHS_L_4_YAGEO.pdf?rev=138&sc=0
R14 R15 = RES000008756: DB_PART_TYPE: SMD; DB_MANUFACTURER_PART: YAGEO    AC1206FR-070RL; NOTE: <NOTE>; DB_T_RANGE: -55 to 155; DB_POWER: 1/4W; DB_PACKAGE: 1206; DB_DESCRIPTION: R SMD 0R 1% 1/4W 1206; DB_CERTIFIED: AUT; DB_PRICE: ISHIDDEN=T; DB_APPROVED_BY: VSN; DB_STATUS: NEW; R_BDS: R; DB_PART_NUMBER: RES000008756; DB_PCB_DEVICE: SMD_1206_RESC3216X65N; DB_LEADTIME: ISHIDDEN=T; DB_MOQ: ISHIDDEN=T; DB_PRICE_DATE: ISHIDDEN=T; DB_APPROVED_ON: 27.04.2012 12:25:00; DB_DATASHEET: http://john.epiqdesign.com/projects/CIS_Datasheets/RES_AC_YAGEO.pdf?rev=263&sc=0
R16 = R_42k: DB_PART_NUMBER: RES000001590; DB_PART_TYPE: SMD; DB_MANUFACTURER_PART: YAGEO    RC0603FR-0741K2; NOTE: <NOTE>; R_BDS: R; DB_T_RANGE: -55 to 155; DB_POWER: 1/10W; DB_PACKAGE: 0603; DB_DESCRIPTION: R SMD 41K2 1% 1/10W 0603; DB_CERTIFIED: ISHIDDEN=T; DB_PRICE: 0.00063; DB_MOQ: 5000; DB_APPROVED_ON: 09.10.2010 г.; DB_STATUS: NEW; DB_PCB_DEVICE: SMD_0603_RESC1608X55N; DB_PRICE_DATE: 2010-12-23; DB_APPROVED_BY: ISHIDDEN=T; DB_DATASHEET: http://john.epiqdesign.com/projects/CIS_Datasheets/PYu-RC0603_51_RoHS_L_4_YAGEO.pdf?rev=138&sc=0
R17 = RES000006287: DB_PART_TYPE: SMD; DB_MANUFACTURER_PART: YAGEO    RC0603FR-0730K; NOTE: <NOTE>; DB_T_RANGE: -55 to 155; DB_POWER: 1/10W; DB_PACKAGE: 0603; DB_DESCRIPTION: R SMD 30K 1% 1/10W 0603; DB_CERTIFIED: ISHIDDEN=T; DB_PRICE: 0.00063; DB_MOQ: 5000; DB_STATUS: NEW; R_BDS: R; DB_PART_NUMBER: RES000006287; DB_PCB_DEVICE: SMD_0603_RESC1608X55N; DB_PRICE_DATE: 2010-12-23; DB_APPROVED_BY: ISHIDDEN=T; DB_APPROVED_ON: 09.10.2010; DB_DATASHEET: http://john.epiqdesign.com/projects/CIS_Datasheets/PYu-RC0603_51_RoHS_L_4_YAGEO.pdf?rev=138&sc=0
R26 = RES000008663: DB_PART_TYPE: SMD; DB_MANUFACTURER_PART: YAGEO    RC0603FR-0710KL; NOTE: <NOTE>; DB_T_RANGE: -55 to 155; DB_POWER: 1/10W; DB_PACKAGE: 0603; DB_DESCRIPTION: R SMD 10k 1% 1/10W 0603; DB_APPROVED_BY: VSN; DB_STATUS: NEW; R_BDS: R; DB_PART_NUMBER: RES000008663; DB_PCB_DEVICE: SMD_0603_RESC1608X55N; DB_APPROVED_ON: 08.08.2011 08:31:51; DB_DATASHEET: http://john.epiqdesign.com/projects/CIS_Datasheets/PYu-RC0603_51_RoHS_L_4_YAGEO.pdf?rev=138&sc=0
R27 = RES000008586: DB_PART_TYPE: SMD; DB_MANUFACTURER_PART: YAGEO       AC0603FR-072KL; NOTE: <NOTE>; DB_T_RANGE: -55 to 155; DB_POWER: 1/10W; DB_PACKAGE: 0603; DB_DESCRIPTION: R SMD 2k 1% 1/10W 0603; DB_CERTIFIED: AUT; DB_PRICE: ISHIDDEN=T; DB_APPROVED_BY: VSN; DB_STATUS: NEW; R_BDS: R; DB_PART_NUMBER: RES000008586; DB_PCB_DEVICE: SMD_0603_RESC1608X55N; DB_LEADTIME: ISHIDDEN=T; DB_MOQ: ISHIDDEN=T; DB_PRICE_DATE: ISHIDDEN=T; DB_APPROVED_ON: 03.05.2011 11:15:27; DB_DATASHEET: http://john.epiqdesign.com/projects/CIS_Datasheets/RES_AC_YAGEO.pdf?rev=263&sc=0
R33 = RES000008926: DB_PART_TYPE: SMD; DB_MANUFACTURER_PART: YAGEO    AC0603FR-070RL; NOTE: <NOTE>; DB_T_RANGE: -55 to 155; DB_POWER: 1/10W; DB_PACKAGE: 0603; DB_DESCRIPTION: R SMD 0R 1% 1/10W 0603; DB_CERTIFIED: AUT; DB_APPROVED_BY: VSN; DB_STATUS: NEW; R_BDS: R; DB_PART_NUMBER: RES000008926; DB_PCB_DEVICE: SMD_0603_RESC1608X55N; DB_APPROVED_ON: 21.05.2013 09:19:53; DB_DATASHEET: http://john.epiqdesign.com/projects/CIS_Datasheets/RES_AC_YAGEO.pdf?rev=263&sc=0
R34 = RES000007051: DB_PART_TYPE: SMD; DB_MANUFACTURER_PART: YAGEO    RC1206JR-072R; NOTE: <NOTE>; DB_T_RANGE: -55 to 155; DB_POWER: 1/4W; DB_PACKAGE: 1206; DB_DESCRIPTION: R SMD 2R 5% 1/4W 1206; DB_CERTIFIED: ISHIDDEN=T; DB_STATUS: NEW; R_BDS: R; DB_PART_NUMBER: RES000007051; DB_PCB_DEVICE: SMD_1206_RESC3216X65N; DB_PRICE: ISHIDDEN=T; DB_LEADTIME: ISHIDDEN=T; DB_MOQ: ISHIDDEN=T; DB_PRICE_DATE: ISHIDDEN=T; DB_APPROVED_BY: ISHIDDEN=T; DB_APPROVED_ON: 09.10.2010; DB_DATASHEET: http://john.epiqdesign.com/projects/CIS_Datasheets/PYu-RC1206_51_RoHS_L_4_YAGEO.pdf?rev=138&sc=0
TP2 TP5-TP7 TP10-TP13 TP17-TP26 TP123-TP129 TP131 TP132 = TPO000000001: DB_PART_TYPE: Test Point; DB_VALUE: 100_254; DB_PACKAGE: ISHIDDEN=T; DB_DESCRIPTION: Test Point 100_254; DB_STATUS: NEW; DB_PART_NUMBER: TPO000000001; DB_DIAMETER: 100_254; DB_PCB_DEVICE: SMD_TP_100-254; DB_MANUFACTURER_PART: ISHIDDEN=T; DB_CERTIFIED: ISHIDDEN=T; DB_PRICE: ISHIDDEN=T; DB_LEADTIME: ISHIDDEN=T; DB_MOQ: ISHIDDEN=T; DB_PRICE_DATE: ISHIDDEN=T; DB_APPROVED_BY: ISHIDDEN=T; DB_APPROVED_ON: 10.09.2010; DB_DATASHEET: ISHIDDEN=T
U6 = PSU000000127: DB_PART_TYPE: Linear Voltage Regulator; DB_MANUFACTURER_PART: ROHM        BD33KA5WF-E2; DB_T_RANGE: -40 to 105; DB_VOLTAGE: 3.3V; DB_CURRENT: 500mA; DB_PACKAGE: SOIC-8; DB_DESCRIPTION: IC BD33KA5WF-E2 SOIC-8; DB_CERTIFIED: ISHIDDEN=T; DB_APPROVED_BY: VSN; DB_STATUS: NEW; DB_PART_NUMBER: PSU000000127; DB_PCB_DEVICE: SMD_SOIC127P620X160-8N; DB_APPROVED_ON: 07.05.2014 13:18:28; DB_DATASHEET: http://john.epiqdesign.com/projects/CIS_Datasheets/IC_bdxxka5wf-e-209388.pdf?rev=1408&sc=0
U7 = PSU000000129: DB_PART_TYPE: Linear Voltage Regulator; DB_MANUFACTURER_PART: ST       L7805CD2T-TR; NOTE: <NOTE>; DB_T_RANGE: 0 to 125; DB_VOLTAGE: 5V; DB_CURRENT: 1A; DB_PACKAGE: D2PAK; DB_DESCRIPTION: IC  L7805CD2T-TR  D2PAK; DB_CERTIFIED: ISHIDDEN=T; DB_APPROVED_BY: VSN; DB_STATUS: NEW; DB_PART_NUMBER: PSU000000129; DB_PCB_DEVICE: SMD_TO254P1542X460-3_4N; DB_APPROVED_ON: 07.05.2014 13:29:21; DB_DATASHEET: http://john.epiqdesign.com/projects/CIS_Datasheets/IC_L7805C.pdf?rev=1409&sc=0
U8 = PSU000000031: DB_PART_TYPE: Linear Voltage Regulator; DB_MANUFACTURER_PART: ON Semiconductor       MC78M05BDTRKG; NOTE: <NOTE>; DB_T_RANGE: -40 to 125; DB_VOLTAGE: 5V; DB_CURRENT: 500mA; DB_DROP_VOLTAGE: 2V; DB_PACKAGE: DPAK; DB_DESCRIPTION: IC  MC78M05BDTRKG  DPAK; DB_CERTIFIED: ISHIDDEN=T; DB_APPROVED_BY: VSN; DB_STATUS: NEW; DB_PART_NUMBER: PSU000000031; DB_PCB_DEVICE: SMD_TO229P991X239-4N_DPAK; DB_PRICE: ISHIDDEN=T; DB_LEADTIME: ISHIDDEN=T; DB_MOQ: ISHIDDEN=T; DB_PRICE_DATE: ISHIDDEN=T; DB_APPROVED_ON: 31.03.2011 10:50:15; DB_DATASHEET: http://john.epiqdesign.com/projects/CIS_Datasheets/MC78M00-D_ONSEMI.pdf?rev=192&sc=0
U9 U29 = PSU000000128: DB_PART_TYPE: Linear Voltage Regulator; DB_MANUFACTURER_PART: ROHM        BD00KA5WF-E2; DB_T_RANGE: -40 to 105; DB_VOLTAGE: 3.3V; DB_CURRENT: 500mA; DB_PACKAGE: SOIC-8; DB_DESCRIPTION: IC BD00KA5WF-E2 SOIC-8; DB_CERTIFIED: ISHIDDEN=T; DB_APPROVED_BY: VSN; DB_STATUS: NEW; DB_PART_NUMBER: PSU000000128; DB_PCB_DEVICE: SMD_SOIC127P620X160-8N; DB_APPROVED_ON: 07.05.2014 13:19:57; DB_DATASHEET: http://john.epiqdesign.com/projects/CIS_Datasheets/IC_bdxxka5wf-e-209388.pdf?rev=1408&sc=0
U10 = MCU000000070: DB_PART_TYPE: DSP; DB_MANUFACTURER_PART: MICROCHIP        DSPIC33EP256MU806-E/PT; OriginalSymbolOrigin: (30000,20000); < Value >: Type; DeviceNumbering: Alpha; DeviceDesignator: A; DevicesInPackage: 1; IsHeterogeneous: False; DB_T_RANGE: -40 to 125; DB_PACKAGE: TQFP-64; DB_DESCRIPTION: IC dsPIC33EP256MU806 TQFP-64; DB_CERTIFIED: AUT; DB_PRICE: ISHIDDEN=T; DB_APPROVED_BY: VSN; DB_STATUS: NEW; Package: <Package>; DevicesInView: 1; PackageName: PIC24FJ16GA004_X_PT; DB_PART_NUMBER: MCU000000070; DB_PCB_DEVICE: SMD_QFP50P1200X1200X120-64N; DB_LEADTIME: ISHIDDEN=T; DB_MOQ: ISHIDDEN=T; DB_PRICE_DATE: ISHIDDEN=T; DB_APPROVED_ON: 17.07.2012 14:21:28; DB_DATASHEET: http://john.epiqdesign.com/projects/CIS_Datasheets/dsPIC33EPxxx-Microchip.pdf?rev=798&sc=0
U28 = PSU000000125: DB_PART_TYPE: Linear Voltage Regulator; DB_MANUFACTURER_PART: DIODES        AP78L05SG-13; DB_T_RANGE: -40 to 125; DB_VOLTAGE: 5V; DB_CURRENT: 100mA; DB_PACKAGE: SOIC-8; DB_DESCRIPTION: IC AP78L05SG-13 SOIC-8; DB_CERTIFIED: ISHIDDEN=T; DB_APPROVED_BY: VSN; DB_STATUS: NEW; DB_PART_NUMBER: PSU000000125; DB_PCB_DEVICE: SMD_SOIC127P600X175-8N; DB_APPROVED_ON: 07.05.2014 12:58:07; DB_DATASHEET: http://john.epiqdesign.com/projects/CIS_Datasheets/IC_AP78LXX.pdf?rev=1405&sc=0
Y1 = OSC000000012: DB_PART_TYPE: Oscillator; DB_MANUFACTURER_PART: IQD       4.00MHz HC49/4HSMX; NOTE: <NOTE>; DB_ACCURACY: 100ppm; DB_T_RANGE: -10 to 60; DB_FREQUENCY: 4MHz; DB_PACKAGE: SMD; DB_DESCRIPTION: IC  4.00MHz HC49/4HSMX  SMD; DB_CERTIFIED: ISHIDDEN=T; DB_APPROVED_BY: VSN; DB_STATUS: NEW; DB_PART_NUMBER: OSC000000012; DB_PCB_DEVICE: SMD_HC49_XTAL1140X480X420N; DB_PRICE: ISHIDDEN=T; DB_LEADTIME: ISHIDDEN=T; DB_MOQ: ISHIDDEN=T; DB_PRICE_DATE: ISHIDDEN=T; DB_APPROVED_ON: 26.04.2012 15:32:29; DB_DATASHEET: http://john.epiqdesign.com/projects/CIS_Datasheets/hc49-4hsmx_IQD_oscillators.pdf?rev=713&sc=0